# Altium schematic sheet Interfaces.SchDoc
size A
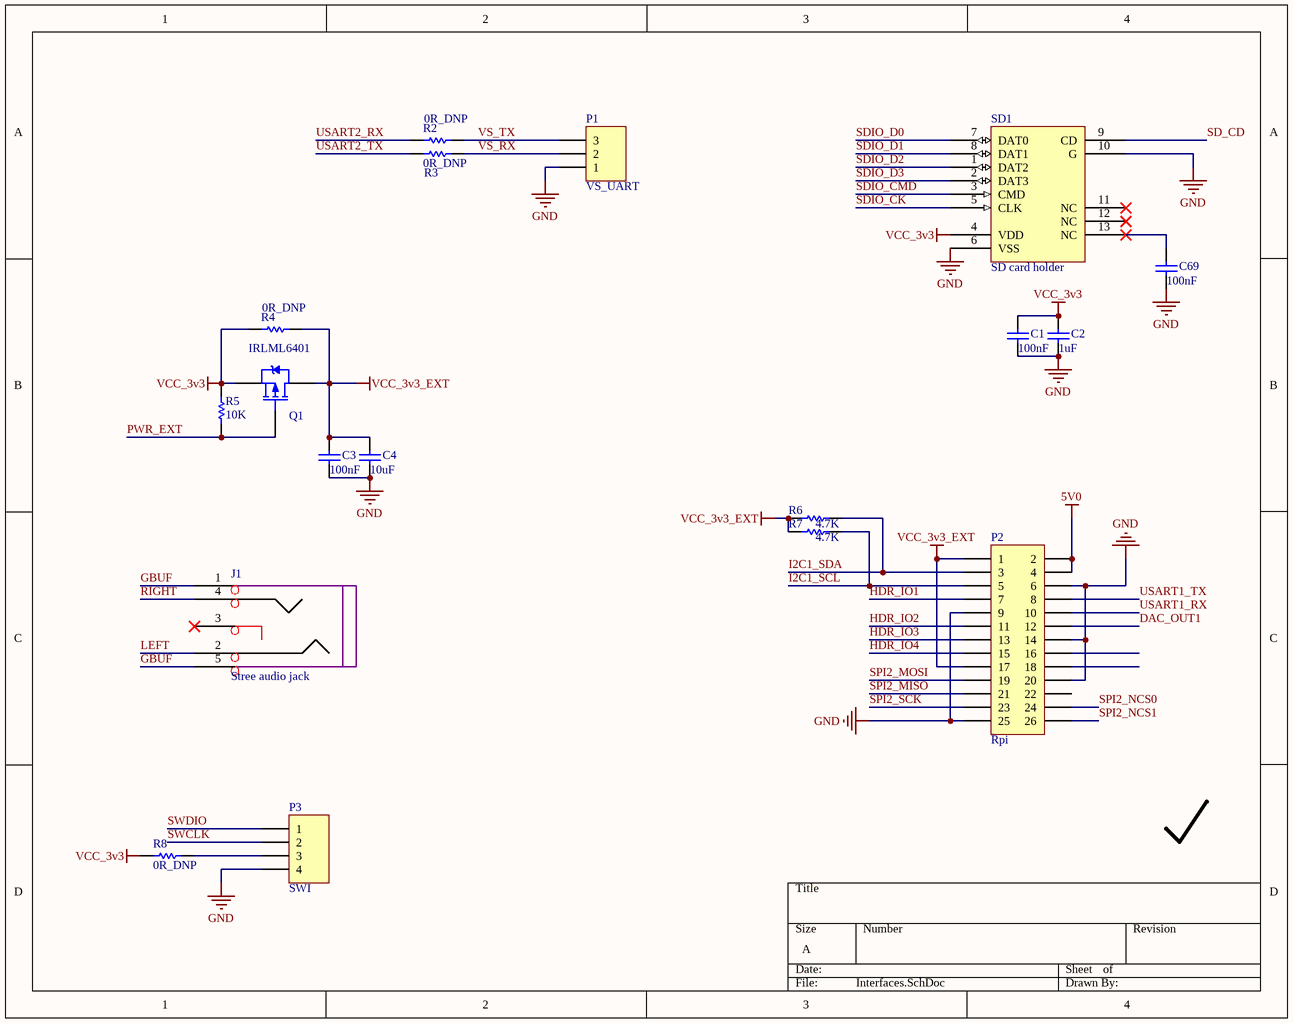
[diagram p0: Interfaces.SchDoc]

## Parts
C1  value 100nF  [0603PKG]  (hidden comment: Cap)
C2  value 1uF  [0603PKG]  (hidden comment: Cap)
C3  value 100nF  [0603PKG]  (hidden comment: Cap)
C4  value 10uF  [0603PKG]  (hidden comment: Cap)
C69  value 100nF  [0603PKG]  (hidden comment: Cap)
J1  Stree audio jack  [Audio Jack]
P1  VS_UART  [XH_3Pin_RA]
P2  Rpi  [HDR2X13]
P3  SWI  [XH_4Pin_RA]
Q1  IRLML6401  [SOT23]
R2  value 0R_DNP  [0603PKG]  (hidden comment: Res1)
R3  value 0R_DNP  [0603PKG]  (hidden comment: Res1)
R4  value 0R_DNP  [0603PKG]  (hidden comment: Res1)
R5  value 10K  [0603PKG]  (hidden comment: Res1)
R6  value 4.7K  [0603PKG]  (hidden comment: Res1)
R7  value 4.7K  [0603PKG]  (hidden comment: Res1)
R8  value 0R_DNP  [0603PKG]  (hidden comment: Res1)
SD1  SD card holder  [MicroSD socket]

## Nets
5V0: P2.2 P2.4
GND: C1.1 C2.1 C3.1 C4.1 C69.1 P1.1 P2.6 P2.9 P2.14 P2.20 P2.25 P3.4 SD1.6(VSS) SD1.10(G)
VCC_3v3: C1.2 C2.2 Q1.2(S) R4.1 R5.1 R8.1 SD1.4(VDD)
VCC_3v3_EXT: C3.2 C4.2 P2.1 P2.17 Q1.3(D) R4.2 R6.1 R7.1
DAC_OUT1: P2.12
GBUF: J1.1(GND) J1.5(GND)
HDR_IO1: P2.7
HDR_IO2: P2.11
HDR_IO3: P2.13
HDR_IO4: P2.15
I2C1_SCL: P2.5 R7.2
I2C1_SDA: P2.3 R6.2
LEFT: J1.2(LEFT)
PWR_EXT: Q1.1(G) R5.2
RIGHT: J1.4(RIGHT)
SD_CD: SD1.9(CD)
SDIO_CK: SD1.5(CLK)
SDIO_CMD: SD1.3(CMD)
SDIO_D0: SD1.7(DAT0)
SDIO_D1: SD1.8(DAT1)
SDIO_D2: SD1.1(DAT2)
SDIO_D3: SD1.2(DAT3)
SPI2_MISO: P2.21
SPI2_MOSI: P2.19
SPI2_NCS0: P2.24
SPI2_NCS1: P2.26
SPI2_SCK: P2.23
SWCLK: P3.2
SWDIO: P3.1
USART1_RX: P2.10
USART1_TX: P2.8
USART2_RX: R2.1
USART2_TX: R3.2
VS_RX: P1.2 R3.1
VS_TX: P1.3 R2.2
NetC69_2: C69.2 SD1.13(NC)
NetP3_3: P3.3 R8.2

Not connected (* = marked no-connect by the designer): J1 3(SW)*; P2 16 18 22; SD1 11(NC)* 12(NC)*

## Library data of the parts
C1-C4 C69 = Cap: Capacitor; Published: 8-Jun-2000; LatestRevisionDate: 17-Jul-2002; LatestRevisionNote: Re-released for DXP Platform.; PackageReference: RAD-0.3; Publisher: Altium Limited; PackageDescription: Radial Cap, Thru-Hole; 2 Leads; 0.3 in Pin Spacing
J1 = Audio Jack
P1 = Header 3: Header, 3-Pin; LatestRevisionDate: 17-Jul-2002; LatestRevisionNote: Re-released for DXP Platform.; Publisher: Altium Limited
P2 = Header 13X2: Header, 13-Pin, Dual row; LatestRevisionDate: 17-Jul-2002; LatestRevisionNote: Re-released for DXP Platform.; Publisher: Altium Limited
P3 = Header 4: Header, 4-Pin; LatestRevisionDate: 17-Jul-2002; LatestRevisionNote: Re-released for DXP Platform.; Publisher: Altium Limited
Q1 = PMOS-2: P-Channel Power MOSFET; Note: Pin 4 not drawn and electrically connected to Pin 2.; Published: 8-Jun-2000; LatestRevisionDate: 17-Jul-2002; LatestRevisionNote: Re-released for DXP Platform.; DatasheetVersion: PD-9.390D; PackageVersion: Feb-1997; PackageReference: TO-220AB; Publisher: Altium Limited; PackageDescription: TO, Thru-Hole, Vertical, Heatsink Mounted; 3 In-Line Leads; Pitch 2.54 mm; ComponentLink1Description: Manufacturer Link; ComponentLink1URL: http://www.irf.com/
R2-R8 = Res1: Resistor; Published: 8-Jun-2000; LatestRevisionDate: 17-Jul-2002; LatestRevisionNote: Re-released for DXP Platform.; PackageReference: AXIAL-0.3; Publisher: Altium Limited; PackageDescription: Axial Device, Thru-Hole; 2 Leads; 0.3 in Pin Spacing
SD1 = MicroSD_holder